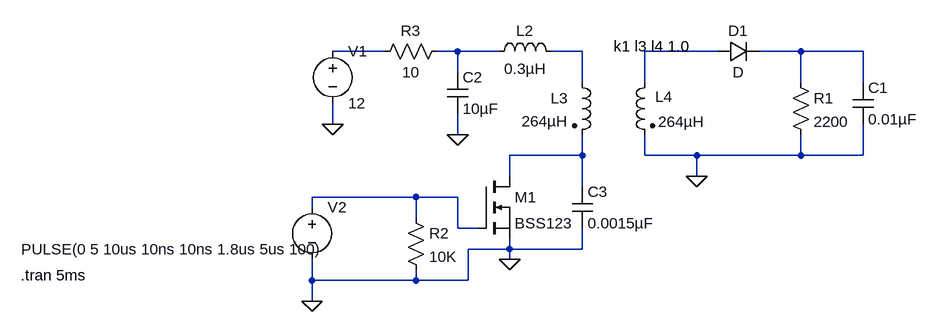
[diagram p0: schematic ps2.asc]
ps2.asc, the LTspice schematic file:
Version 4
SHEET 1 892 680
WIRE 32 80 -48 80
WIRE 144 80 112 80
WIRE 208 80 144 80
WIRE 336 80 288 80
WIRE 544 80 432 80
WIRE 672 80 608 80
WIRE 768 80 672 80
WIRE 144 112 144 80
WIRE 336 128 336 80
WIRE 432 128 432 80
WIRE 672 128 672 80
WIRE 768 128 768 80
WIRE -48 192 -48 160
WIRE 144 208 144 176
WIRE 336 240 336 208
WIRE 336 240 224 240
WIRE 432 240 432 208
WIRE 512 240 432 240
WIRE 672 240 672 208
WIRE 672 240 512 240
WIRE 768 240 768 192
WIRE 768 240 672 240
WIRE 224 272 224 240
WIRE 512 272 512 240
WIRE 336 288 336 240
WIRE 80 304 -80 304
WIRE 144 304 80 304
WIRE -80 320 -80 304
WIRE 80 336 80 304
WIRE 144 352 144 304
WIRE 176 352 144 352
WIRE 224 384 224 368
WIRE 224 384 160 384
WIRE 336 384 336 352
WIRE 336 384 224 384
WIRE 224 400 224 384
WIRE -80 432 -80 400
WIRE 80 432 80 416
WIRE 80 432 -80 432
WIRE 160 432 160 384
WIRE 160 432 80 432
WIRE -80 464 -80 432
FLAG 512 272 0
FLAG 224 400 0
FLAG -48 192 0
FLAG -80 464 0
FLAG 144 208 0
SYMBOL ind 192 96 R270
WINDOW 0 32 56 VTop 2
WINDOW 3 5 56 VBottom 2
SYMATTR InstName L2
SYMATTR Value 0.3µH
SYMBOL ind2 320 112 R0
WINDOW 0 -33 40 Left 2
WINDOW 3 -77 75 Left 2
SYMATTR InstName L3
SYMATTR Value 264µH
SYMATTR Type ind
SYMATTR SpiceLine Rser=1.5
SYMBOL ind2 448 112 M0
WINDOW 0 -27 38 Left 2
WINDOW 3 -76 76 Left 2
SYMATTR InstName L4
SYMATTR Value 264µH
SYMATTR Type ind
SYMBOL diode 544 96 R270
WINDOW 0 32 32 VTop 2
WINDOW 3 0 32 VBottom 2
SYMATTR InstName D1
SYMBOL res 656 112 R0
SYMATTR InstName R1
SYMATTR Value 2200
SYMBOL cap 752 128 R0
SYMATTR InstName C1
SYMATTR Value 0.01µF
SYMBOL nmos 176 272 R0
SYMATTR InstName M1
SYMATTR Value BSS123
SYMBOL voltage -48 64 R0
WINDOW 123 0 0 Left 2
WINDOW 39 0 0 Left 2
SYMATTR InstName V1
SYMATTR Value 12
SYMBOL voltage -80 304 R0
WINDOW 3 -447 80 Left 2
WINDOW 123 0 0 Left 2
WINDOW 39 0 0 Left 2
SYMATTR Value PULSE(0 5 10us 10ns 10ns 1.8us 5us 100)
SYMATTR InstName V2
SYMBOL res 64 320 R0
SYMATTR InstName R2
SYMATTR Value 10K
SYMBOL cap 320 288 R0
SYMATTR InstName C3
SYMATTR Value 0.0015µF
SYMBOL res 128 64 R90
WINDOW 0 0 56 VBottom 2
WINDOW 3 32 56 VTop 2
SYMATTR InstName R3
SYMATTR Value 10
SYMBOL cap 128 112 R0
SYMATTR InstName C2
SYMATTR Value 10µF
TEXT 384 72 Left 2 !k1 l3 l4 1.0
TEXT -528 424 Left 2 !.tran 5ms

The netlist it stands for:
* ps2.asc
L2 N002 N003 0.3µH
L3 N003 N006 264µH Rser=1.5
L4 N004 0 264µH
D1 N004 N005 D
R1 N005 0 2200
C1 N005 0 0.01µF
M1 N006 N007 0 0 BSS123
V1 N001 0 12
V2 N007 0 PULSE(0 5 10us 10ns 10ns 1.8us 5us 100)
R2 N007 0 10K
C3 N006 0 0.0015µF
R3 N002 N001 10
C2 N002 0 10µF
.model D D
.lib standard.dio
.model NMOS NMOS
.model PMOS PMOS
.lib standard.mos
k1 l3 l4 1.0
.tran 5ms
.backanno
.end